# Altium schematic sheet POWER.SchDoc
size A4; SheetNumber: 3; SheetTotal: 3
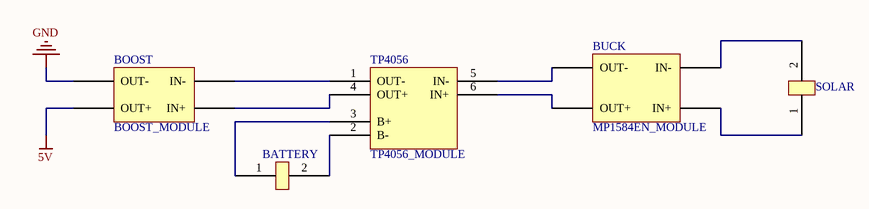
[diagram p0: POWER.SchDoc]

## Parts
BATTERY  PAD_SW  [PAD_SW]  (value not drawn)
BOOST  BOOST_MODULE  [BOOST_MODULE_MINI]
BUCK  MP1584EN_MODULE  [MP1584EN_MODULE]
SOLAR  SOLAR  [PAD_SW]  (value not drawn)
TP4056  TP4056_MODULE  [TP4056_MODULE]

## Nets
5V: BOOST.3(OUT+)
GND: BOOST.4(OUT-)
NetBATTERY_1: BATTERY.1(SW1) TP4056.3(B+)
NetBATTERY_2: BATTERY.2(SW2) TP4056.2(B-)
NetBOOST_1: BOOST.1(IN+) TP4056.4(OUT+)
NetBOOST_2: BOOST.2(IN-) TP4056.1(OUT-)
NetBUCK_1: BUCK.1(IN+) SOLAR.1(SW1)
NetBUCK_2: BUCK.2(IN-) SOLAR.2(SW2)
NetBUCK_3: BUCK.3(OUT+) TP4056.6(IN+)
NetBUCK_4: BUCK.4(OUT-) TP4056.5(IN-)

## Library data of the parts
SOLAR = PAD_SW